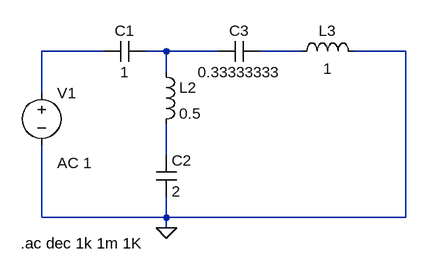
[diagram p0: schematic Ej1.asc]
Ej1.asc, the LTspice schematic file:
Version 4
SHEET 1 880 680
WIRE 112 128 16 128
WIRE 208 128 176 128
WIRE 288 128 208 128
WIRE 416 128 352 128
WIRE 576 128 496 128
WIRE 208 160 208 128
WIRE 16 192 16 128
WIRE 208 288 208 240
WIRE 16 384 16 272
WIRE 208 384 208 352
WIRE 208 384 16 384
WIRE 576 384 576 128
WIRE 576 384 208 384
WIRE 208 400 208 384
FLAG 208 400 0
SYMBOL cap 176 112 R90
WINDOW 0 0 32 VBottom 2
WINDOW 3 32 32 VTop 2
SYMATTR InstName C1
SYMATTR Value 1
SYMBOL ind 192 144 R0
SYMATTR InstName L2
SYMATTR Value 0.5
SYMBOL cap 192 288 R0
SYMATTR InstName C2
SYMATTR Value 2
SYMBOL cap 352 112 R90
WINDOW 0 0 32 VBottom 2
WINDOW 3 32 32 VTop 2
SYMATTR InstName C3
SYMATTR Value 0.33333333
SYMBOL ind 400 144 R270
WINDOW 0 32 56 VTop 2
WINDOW 3 5 56 VBottom 2
SYMATTR InstName L3
SYMATTR Value 1
SYMBOL voltage 16 176 R0
WINDOW 123 24 124 Left 2
WINDOW 39 0 0 Left 0
SYMATTR Value2 AC 1
SYMATTR InstName V1
SYMATTR Value ""
TEXT -16 424 Left 2 !.ac dec 1k 1m 1K

The netlist it stands for:
* Ej1.asc
C1 N002 N001 1
L2 N002 N004 0.5
C2 N004 0 2
C3 N003 N002 0.33333333
L3 N003 0 1
V1 N001 0 AC 1
.ac dec 1k 1m 1K
.backanno
.end